# Altium project slam.PrjPCB
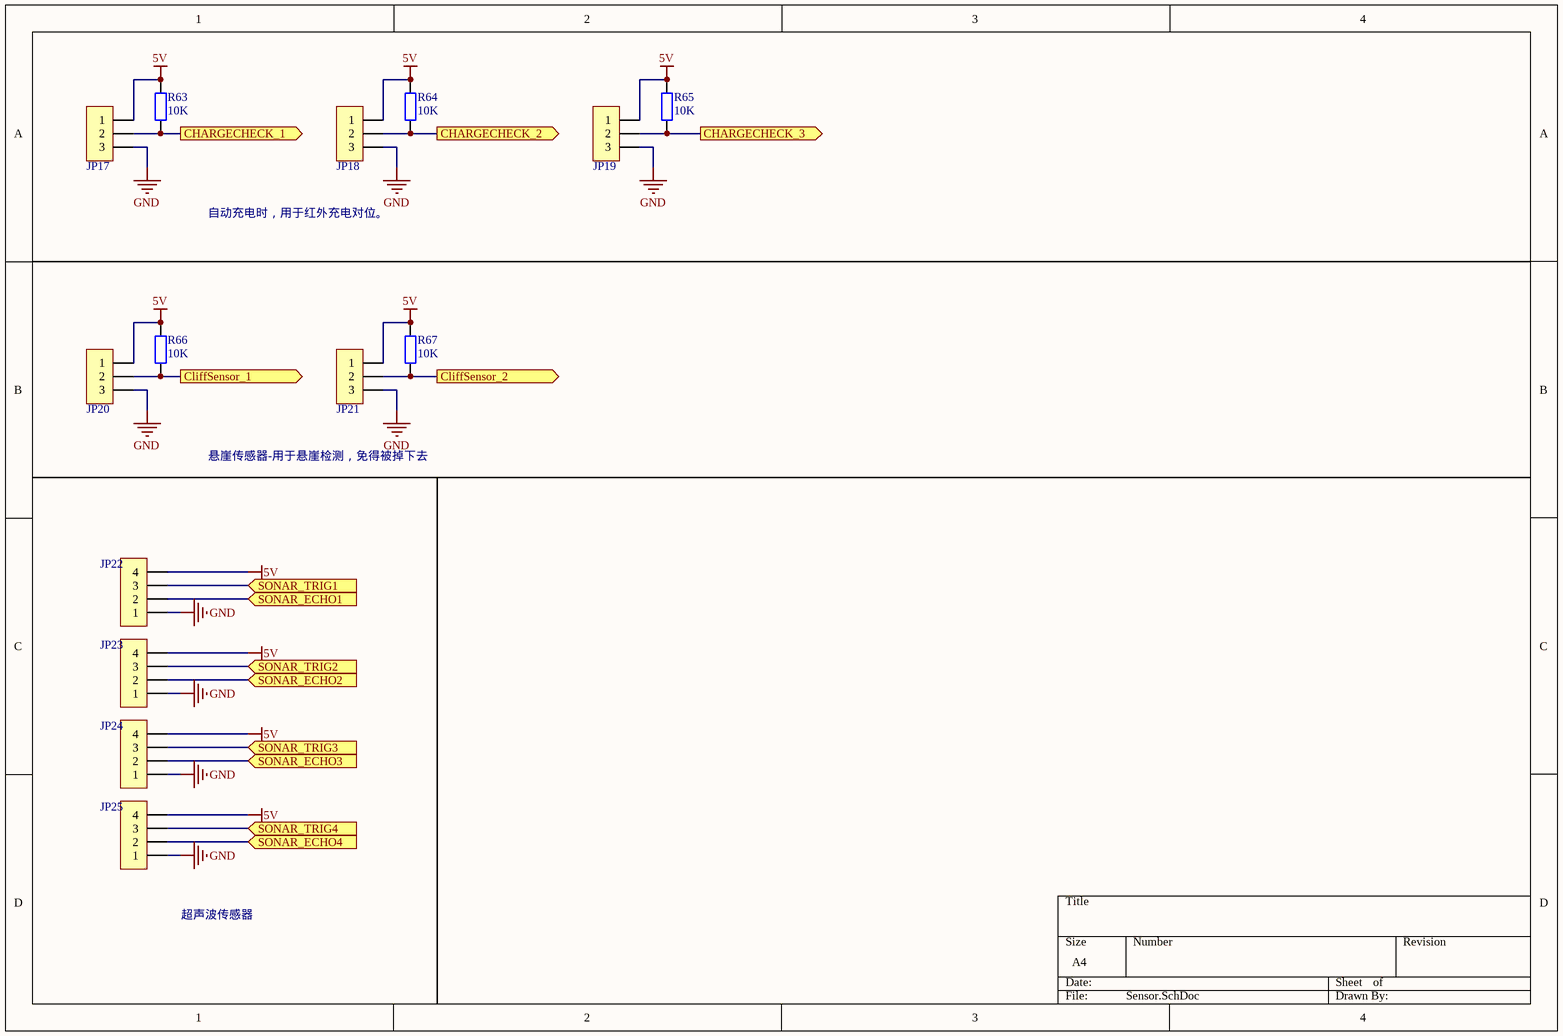
[diagram p0: Sensor.SchDoc]
5 sheets, 120 parts. Net scope: flat (ports and power ports of the same name join across sheets).
Board file: MAIN.PcbDoc
Sheets:
  Sensor.SchDoc
  main.SchDoc
  MOTO.SchDoc
  InputOutput.SchDoc
  tongxun.SchDoc

## Sheet Sensor.SchDoc
size A4

### Parts
JP17  HDR-1X3  [XH2.54-LI-3P]  (value not drawn)
JP18  HDR-1X3  [XH2.54-LI-3P]  (value not drawn)
JP19  HDR-1X3  [XH2.54-LI-3P]  (value not drawn)
JP20  HDR-1X3  [XH2.54-LI-3P]  (value not drawn)
JP21  HDR-1X3  [XH2.54-LI-3P]  (value not drawn)
JP22  HDR-1X4  [XH2.54-LI-4P]  (value not drawn)
JP23  HDR-1X4  [XH2.54-LI-4P]  (value not drawn)
JP24  HDR-1X4  [XH2.54-LI-4P]  (value not drawn)
JP25  HDR-1X4  [XH2.54-LI-4P]  (value not drawn)
R63  10K  [R 0603_M]
R64  10K  [R 0603_M]
R65  10K  [R 0603_M]
R66  10K  [R 0603_M]
R67  10K  [R 0603_M]

### Ports
CHARGECHECK_1 (out), CHARGECHECK_2 (out), CHARGECHECK_3 (out), CliffSensor_1 (out), CliffSensor_2 (out), SONAR_ECHO1 (in), SONAR_ECHO2 (in), SONAR_ECHO3 (in), SONAR_ECHO4 (in), SONAR_TRIG1 (in), SONAR_TRIG2 (in), SONAR_TRIG3 (in), SONAR_TRIG4 (in)

### Nets
5V: JP17.1 JP18.1 JP19.1 JP20.1 JP21.1 JP22.4 JP23.4 JP24.4 JP25.4 R63.2 R64.2 R65.2 R66.2 R67.2
GND: JP17.3 JP18.3 JP19.3 JP20.3 JP21.3 JP22.1 JP23.1 JP24.1 JP25.1
CHARGECHECK_1: JP17.2 R63.1 ; port CHARGECHECK_1
CHARGECHECK_2: JP18.2 R64.1 ; port CHARGECHECK_2
CHARGECHECK_3: JP19.2 R65.1 ; port CHARGECHECK_3
CliffSensor_1: JP21.2 R67.1 ; port CliffSensor_2
CliffSensor_2: JP20.2 R66.1 ; port CliffSensor_1
NetJP22_2: JP22.2 ; port SONAR_ECHO1
NetJP22_3: JP22.3 ; port SONAR_TRIG1
NetJP23_2: JP23.2 ; port SONAR_ECHO2
NetJP23_3: JP23.3 ; port SONAR_TRIG2
NetJP24_2: JP24.2 ; port SONAR_ECHO3
NetJP24_3: JP24.3 ; port SONAR_TRIG3
NetJP25_2: JP25.2 ; port SONAR_ECHO4
NetJP25_3: JP25.3 ; port SONAR_TRIG4

### Notes on the sheet
- 自动充电时，用于红外充电对位。
- 悬崖传感器-用于悬崖检测，免得被掉下去
- 超声波传感器

### Library data of the parts
JP17-JP21 = Header 3: 3P接插件; 版权归属: 源创客; BOM名称: 3P接插件; 学习资源: www.ooocke.com
JP22-JP25 = Header 4: 4P接插件; 版权归属: 源创客; BOM名称: 4P接插件; 学习资源: www.ooocke.com
R63-R67 = R: 贴片电阻; 版权归属: 源创客; BOM名称: 贴片电阻; 学习资源: www.ooocke.com

## Sheet main.SchDoc
size A3
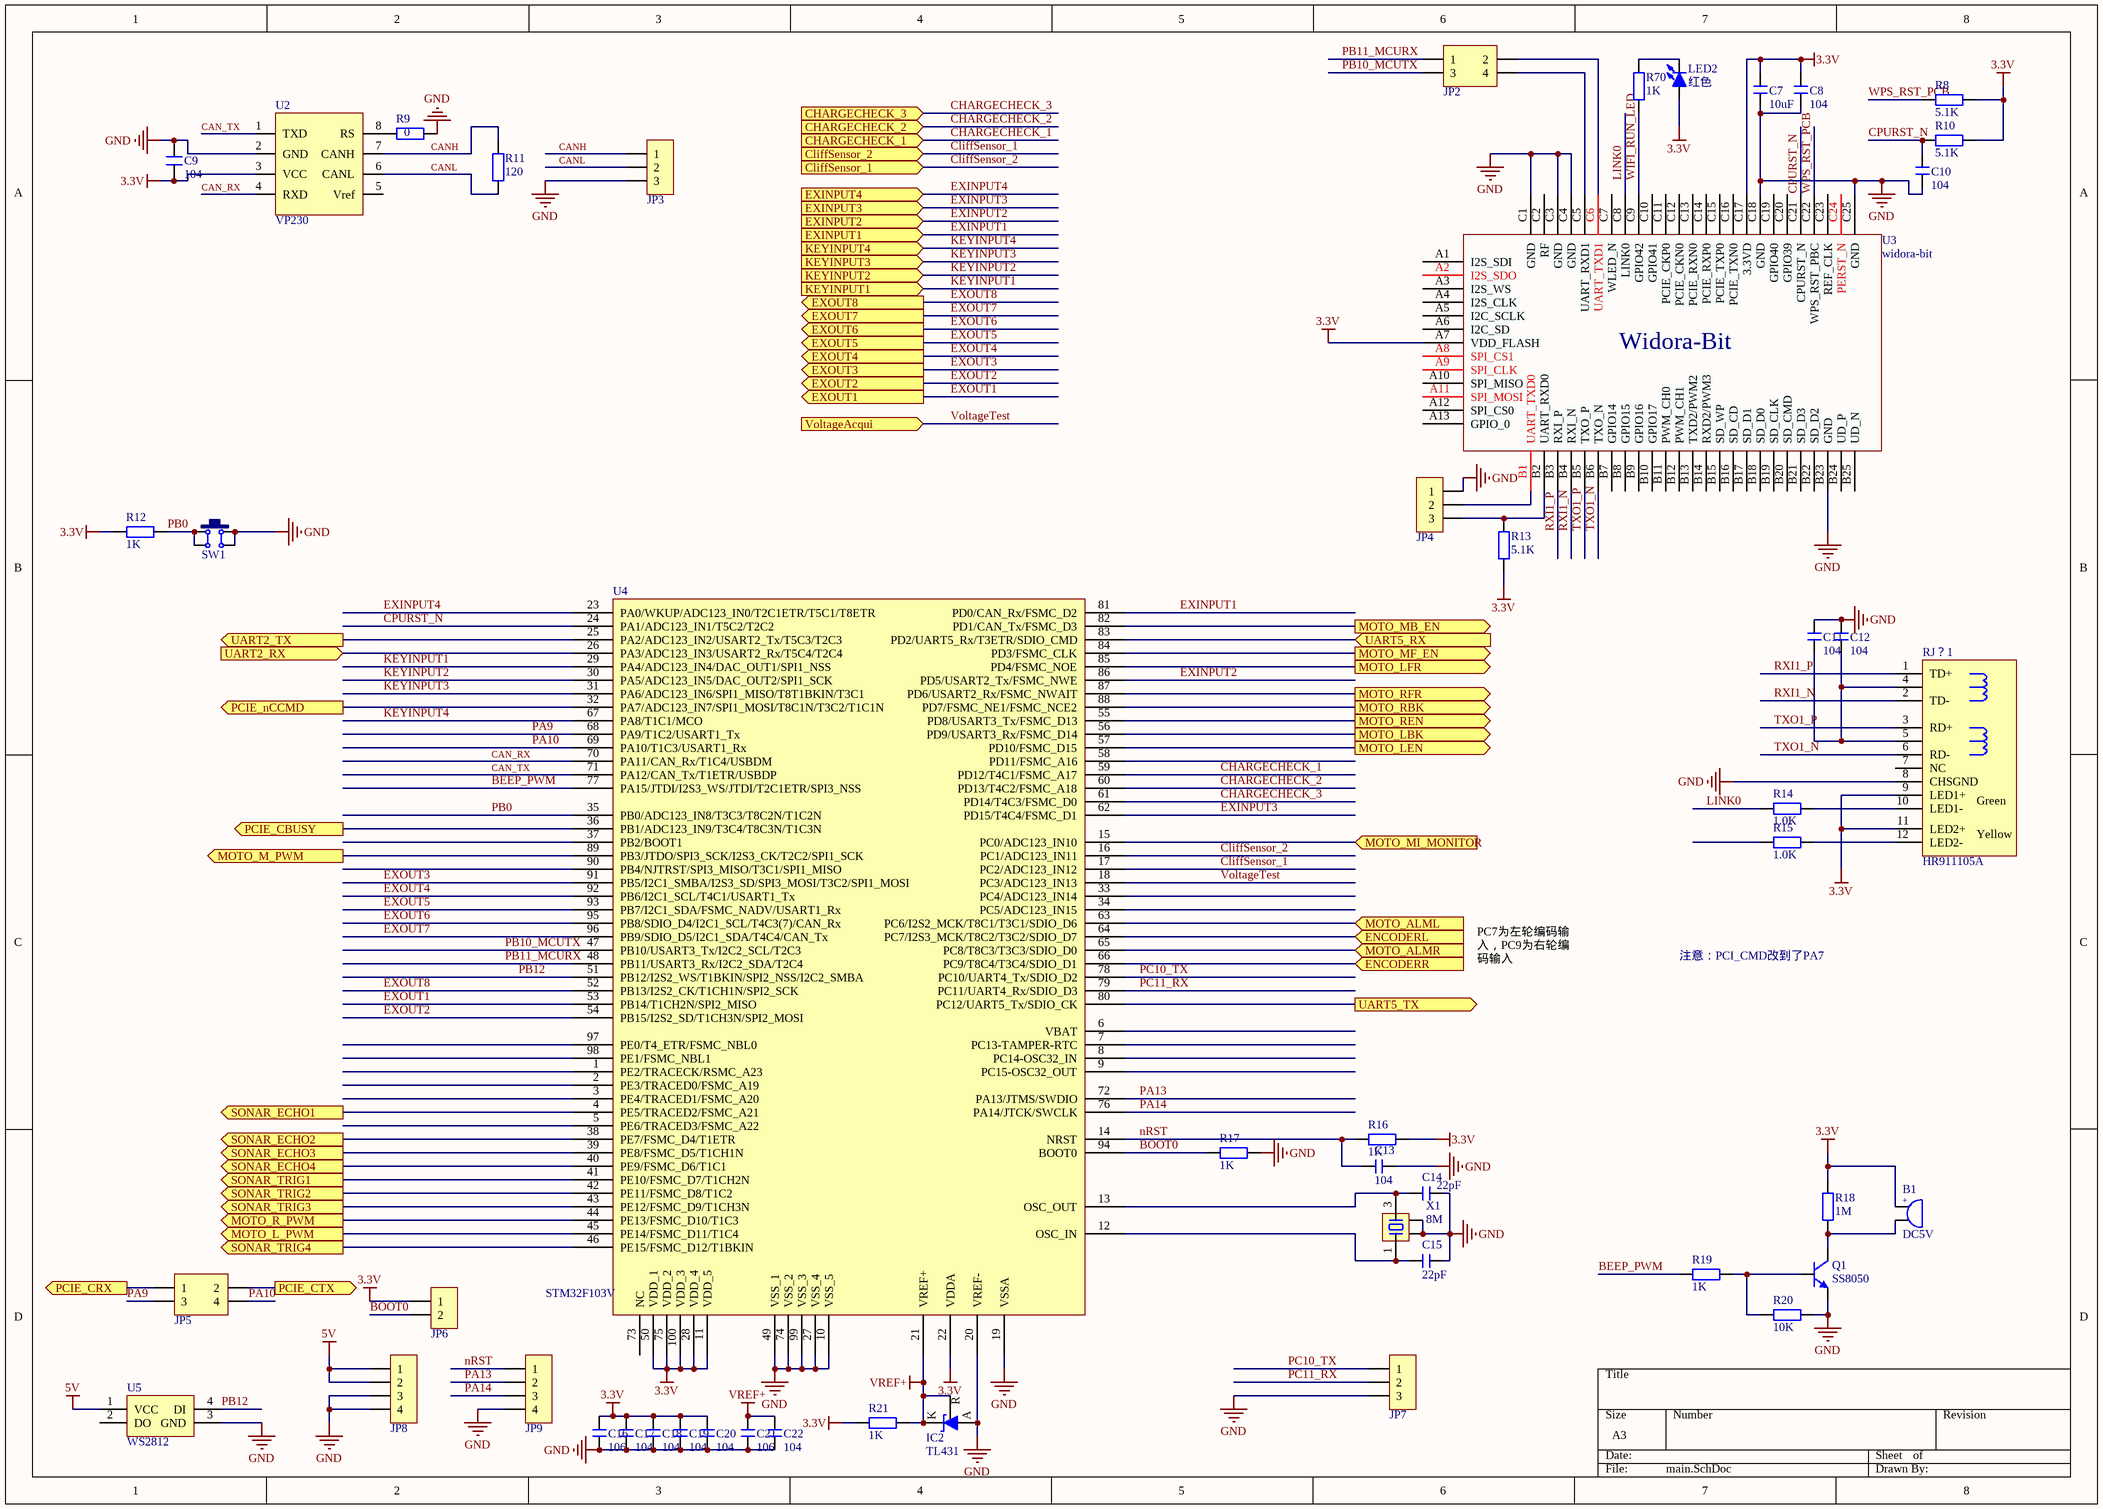
[diagram p1: main.SchDoc]

### Parts
B1  DC5V  [BEEP 6.5x12x8.5]
C7  10uF  [C 0805_L]
C8  104  [C 0603_L]
C9  104  [C 0603_L]
C10  104  [C 0603_L]
C11  104  [C 0603_L]
C12  104  [C 0603_L]
C13  104  [C 0603_L]
C14  22pF  [C 0603_L]
C15  22pF  [C 0603_L]
C16  106  [C 0603_L]
C17  104  [C 0603_L]
C18  104  [C 0603_L]
C19  104  [C 0603_L]
C20  104  [C 0603_L]
C21  106  [C 0603_L]
C22  104  [C 0603_L]
IC2  TL431  [SOT23-3N]
JP2  Header2X2  [HDR2.54-LI-2x2P]  (value not drawn)
JP3  HDR-1X3  [XH2.54-LI-3P]  (value not drawn)
JP4  HDR-1X3  [XH2.54-LI-3P]  (value not drawn)
JP5  Header2X2  [HDR2.54-LI-2x2P]  (value not drawn)
JP6  HDR-1X2  [HDR2.54-LI-2P]  (value not drawn)
JP7  HDR-1X3  [XH2.54-LI-3P]  (value not drawn)
JP8  HDR-1X4  [HDR2.54-LI-2x2P]  (value not drawn)
JP9  HDR-1X4  [XH2.54-LI-4P]  (value not drawn)
LED2  红色  [LED 0603G]
Q1  SS8050  [SOT23-3N]
R8  5.1K  [R 0603_L]
R9  0  [R 0603_L]
R10  5.1K  [R 0603_L]
R11  120  [R 0603_L]
R12  1K  [R 0603_L]
R13  5.1K  [R 0603_L]
R14  1.0K  [R 0603_L]
R15  1.0K  [R 0603_L]
R16  1K  [R 0603_L]
R17  1K  [R 0603_L]
R18  1M  [R 0603_L]
R19  1K  [R 0603_L]
R20  10K  [R 0603_L]
R21  1K  [R 0603_L]
R70  1K  [R 0603_L]
RJ？1  HR911105A  [RJ-45A12]
SW1  6x6x5  [TSW DIP-6*6*6]  (value not drawn)
U2  VP230  [SOP8_N]
U3  widora-bit  [Widora-BIT2]
U4  STM32F103V  [LQFP100 14X14_N]
U5  WS2812  [WS2812]
X1  8M  [OSC 3225-4P]

### Ports
CHARGECHECK_1 (in), CHARGECHECK_2 (in), CHARGECHECK_3 (in), CliffSensor_1 (in), CliffSensor_2 (in), ENCODERL (in), ENCODERR (in), EXINPUT1 (in), EXINPUT2 (in), EXINPUT3 (in), EXINPUT4 (in), EXOUT1 (out), EXOUT2 (out), EXOUT3 (out), EXOUT4 (out), EXOUT5 (out), EXOUT6 (out), EXOUT7 (out), EXOUT8 (out), KEYINPUT1 (in), KEYINPUT2 (in), KEYINPUT3 (in), KEYINPUT4 (in), MOTO_ALML (in), MOTO_ALMR (in), MOTO_L_PWM (out), MOTO_LBK (out), MOTO_LEN (out), MOTO_LFR (out), MOTO_M_PWM (out), MOTO_MB_EN (out), MOTO_MF_EN (out), MOTO_MI_MONITOR (in), MOTO_R_PWM (out), MOTO_RBK (out), MOTO_REN (out), MOTO_RFR (out), PCIE_CBUSY (out), PCIE_CRX (out), PCIE_CTX (out), PCIE_nCCMD (out), SONAR_ECHO1 (out), SONAR_ECHO2 (out), SONAR_ECHO3 (out), SONAR_ECHO4 (out), SONAR_TRIG1 (out), SONAR_TRIG2 (out), SONAR_TRIG3 (out), SONAR_TRIG4 (out), UART2_RX (in), UART2_TX (out), UART5_RX (in), UART5_TX (out), VoltageAcqui (in)

### Nets
3.3V: B1.1 C7.2 C8.2 C9.1 C16.2 C17.2 C18.2 C19.2 C20.2 JP6.1 LED2.1(A) R8.1 R10.1 R12.2 R13.2 R16.1 R18.2 R21.2 RJ？1.9(LED1+) RJ？1.11(LED2+) U2.3(VCC) U3.A7(VDD_FLASH) U3.C17(3.3VD) U4.11(VDD_5) U4.22(VDDA) U4.28(VDD_4) U4.50(VDD_1) U4.75(VDD_2) U4.100(VDD_3)
5V: JP8.1 JP8.2 U5.1(VCC)
GND: C7.1 C8.1 C9.2 C10.1 C11.2 C12.2 C13.1 C14.1 C15.1 C16.1 C17.1 C18.1 C19.1 C20.1 C21.1 C22.1 IC2.3(A) JP3.3 JP4.1 JP7.3 JP8.3 JP8.4 JP9.4 Q1.2(E) R9.2 R17.1 R20.1 RJ？1.8(CHSGND) SW1.2 SW1.3 U2.2(GND) U3.B23(GND) U3.C1(GND) U3.C3(GND) U3.C4(GND) U3.C18(GND) U3.C25(GND) U4.10(VSS_5) U4.19(VSSA) U4.20(VREF-) U4.27(VSS_4) U4.49(VSS_1) U4.74(VSS_2) U4.99(VSS_3) U5.3(GND) X1.2 X1.4
VREF+: C21.2 C22.2 IC2.1(R) IC2.2(K) R21.1 U4.21(VREF+)
BEEP_PWM: R19.2 U4.77(PA15/JTDI/I2S3_WS/JTDI/T2C1ETR/SPI3_NSS)
BOOT0: JP6.2 R17.2 U4.94(BOOT0)
CAN_RX: U2.4(RXD) U4.70(PA11/CAN_Rx/T1C4/USBDM)
CAN_TX: U2.1(TXD) U4.71(PA12/CAN_Tx/T1ETR/USBDP)
CANH: JP3.1 R11.2 U2.7(CANH)
CANL: JP3.2 R11.1 U2.6(CANL)
CHARGECHECK_1: U4.59(PD12/T4C1/FSMC_A17) ; port CHARGECHECK_1
CHARGECHECK_2: U4.60(PD13/T4C2/FSMC_A18) ; port CHARGECHECK_2
CHARGECHECK_3: U4.61(PD14/T4C3/FSMC_D0) ; port CHARGECHECK_3
CliffSensor_1: U4.17(PC2/ADC123_IN12) ; port CliffSensor_2
CliffSensor_2: U4.16(PC1/ADC123_IN11) ; port CliffSensor_1
CPURST_N: C10.2 R10.2 U3.C21(CPURST_N) U4.24(PA1/ADC123_IN1/T5C2/T2C2)
ENABLE_C: U4.89(PB3/JTDO/SPI3_SCK/I2S3_CK/T2C2/SPI1_SCK) ; port MOTO_M_PWM
EXINPUT1: U4.81(PD0/CAN_Rx/FSMC_D2) ; port EXINPUT1
EXINPUT2: U4.86(PD5/USART2_Tx/FSMC_NWE) ; port EXINPUT2
EXINPUT3: U4.62(PD15/T4C4/FSMC_D1) ; port EXINPUT3
EXINPUT4: U4.23(PA0/WKUP/ADC123_IN0/T2C1ETR/T5C1/T8ETR) ; port EXINPUT4
EXOUT1: U4.53(PB14/T1CH2N/SPI2_MISO) ; port EXOUT1
EXOUT2: U4.54(PB15/I2S2_SD/T1CH3N/SPI2_MOSI) ; port EXOUT2
EXOUT3: U4.91(PB5/I2C1_SMBA/I2S3_SD/SPI3_MOSI/T3C2/SPI1_MOSI) ; port EXOUT3
EXOUT4: U4.92(PB6/I2C1_SCL/T4C1/USART1_Tx) ; port EXOUT4
EXOUT5: U4.93(PB7/I2C1_SDA/FSMC_NADV/USART1_Rx) ; port EXOUT5
EXOUT6: U4.95(PB8/SDIO_D4/I2C1_SCL/T4C3(7)/CAN_Rx) ; port EXOUT6
EXOUT7: U4.96(PB9/SDIO_D5/I2C1_SDA/T4C4/CAN_Tx) ; port EXOUT7
EXOUT8: U4.52(PB13/I2S2_CK/T1CH1N/SPI2_SCK) ; port EXOUT8
INPUT_C1: U4.84(PD3/FSMC_CLK) ; port MOTO_MF_EN
INPUT_C2: U4.82(PD1/CAN_Tx/FSMC_D3) ; port MOTO_MB_EN
KEYINPUT1: U4.29(PA4/ADC123_IN4/DAC_OUT1/SPI1_NSS) ; port KEYINPUT1
KEYINPUT2: U4.30(PA5/ADC123_IN5/DAC_OUT2/SPI1_SCK) ; port KEYINPUT2
KEYINPUT3: U4.31(PA6/ADC123_IN6/SPI1_MISO/T8T1BKIN/T3C1) ; port KEYINPUT3
KEYINPUT4: U4.67(PA8/T1C1/MCO) ; port KEYINPUT4
LINK0: R14.1 U3.C8(LINK0)
nRST: C13.2 JP9.1 R16.2 U4.14(NRST)
PA9: JP5.3 U4.68(PA9/T1C2/USART1_Tx)
PA10: JP5.4 U4.69(PA10/T1C3/USART1_Rx)
PA13: JP9.2 U4.72(PA13/JTMS/SWDIO)
PA14: JP9.3 U4.76(PA14/JTCK/SWCLK)
PB0: R12.1 SW1.1 SW1.4 U4.35(PB0/ADC123_IN8/T3C3/T8C2N/T1C2N)
PB10_MCUTX: JP2.3 U4.47(PB10/USART3_Tx/I2C2_SCL/T2C3)
PB11_MCURX: JP2.1 U4.48(PB11/USART3_Rx/I2C2_SDA/T2C4)
PB12: U4.51(PB12/I2S2_WS/T1BKIN/SPI2_NSS/I2C2_SMBA) U5.4(DI)
PC10_TX: JP7.1 U4.78(PC10/UART4_Tx/SDIO_D2)
PC11_RX: JP7.2 U4.79(PC11/UART4_Rx/SDIO_D3)
RXI1_N: RJ？1.2(TD-) U3.B4(RXI_N)
RXI1_P: RJ？1.1(TD+) U3.B3(RXI_P)
TXO1_N: RJ？1.6(RD-) U3.B6(TXO_N)
TXO1_P: RJ？1.3(RD+) U3.B5(TXO_P)
VoltageTest: U4.18(PC3/ADC123_IN13) ; port VoltageAcqui
WIFI_RUN_LED: R70.2 U3.C9(GPIO42)
WPS_RST_PCB: R8.2 U3.C22(WPS_RST_PBC)
NetB1_2: B1.2 Q1.3(C) R18.1
NetC11_1: C11.1 C12.1 RJ？1.4 RJ？1.5
NetC14_2: C14.2 U4.13(OSC_OUT) X1.3
NetC15_2: C15.2 U4.12(OSC_IN) X1.1
NetJP2_2: JP2.2 U3.C6(UART_TXD1)
NetJP2_4: JP2.4 U3.C5(UART_RXD1)
NetJP4_2: JP4.2 U3.B1(UART_TXD0)
NetJP4_3: JP4.3 R13.1 U3.B2(UART_RXD0)
NetJP5_1: JP5.1 ; port PCIE_CRX
NetJP5_2: JP5.2 ; port PCIE_CTX
NetJP22_2: U4.4(PE5/TRACED2/FSMC_A21) ; port SONAR_ECHO1
NetJP22_3: U4.41(PE10/FSMC_D7/T1CH2N) ; port SONAR_TRIG1
NetJP23_2: U4.38(PE7/FSMC_D4/T1ETR) ; port SONAR_ECHO2
NetJP23_3: U4.42(PE11/FSMC_D8/T1C2) ; port SONAR_TRIG2
NetJP24_2: U4.39(PE8/FSMC_D5/T1CH1N) ; port SONAR_ECHO3
NetJP24_3: U4.43(PE12/FSMC_D9/T1CH3N) ; port SONAR_TRIG3
NetJP25_2: U4.40(PE9/FSMC_D6/T1C1) ; port SONAR_ECHO4
NetJP25_3: U4.46(PE15/FSMC_D12/T1BKIN) ; port SONAR_TRIG4
NetLED2_2: LED2.2(K) R70.1
NetQ1_1: Q1.1(B) R19.1 R20.2
NetR9_1: R9.1 U2.8(RS)
NetR14_2: R14.2 RJ？1.10(LED1-)
NetR15_2: R15.2 RJ？1.12(LED2-)
NetR28_1: U4.63(PC6/I2S2_MCK/T8C1/T3C1/SDIO_D6) ; port MOTO_ALML
NetR28_2: U4.64(PC7/I2S3_MCK/T8C2/T3C2/SDIO_D7) ; port ENCODERL
NetR28_3: U4.65(PC8/T8C3/T3C3/SDIO_D0) ; port MOTO_ALMR
NetR28_4: U4.66(PC9/T8C4/T3C4/SDIO_D1) ; port ENCODERR
NetU4_15: U4.15(PC0/ADC123_IN10) ; port MOTO_MI_MONITOR
NetU4_25: U4.25(PA2/ADC123_IN2/USART2_Tx/T5C3/T2C3) ; port UART2_TX
NetU4_26: U4.26(PA3/ADC123_IN3/USART2_Rx/T5C4/T2C4) ; port UART2_RX
NetU4_32: U4.32(PA7/ADC123_IN7/SPI1_MOSI/T8C1N/T3C2/T1C1N) ; port PCIE_nCCMD
NetU4_36: U4.36(PB1/ADC123_IN9/T3C4/T8C3N/T1C3N) ; port PCIE_CBUSY
NetU4_44: U4.44(PE13/FSMC_D10/T1C3) ; port MOTO_R_PWM
NetU4_45: U4.45(PE14/FSMC_D11/T1C4) ; port MOTO_L_PWM
NetU4_55: U4.55(PD8/USART3_Tx/FSMC_D13) ; port MOTO_REN
NetU4_56: U4.56(PD9/USART3_Rx/FSMC_D14) ; port MOTO_LBK
NetU4_57: U4.57(PD10/FSMC_D15) ; port MOTO_LEN
NetU4_80: U4.80(PC12/UART5_Tx/SDIO_CK) ; port UART5_TX
NetU4_83: U4.83(PD2/UART5_Rx/T3ETR/SDIO_CMD) ; port UART5_RX
NetU4_85: U4.85(PD4/FSMC_NOE) ; port MOTO_LFR
NetU4_87: U4.87(PD6/USART2_Rx/FSMC_NWAIT) ; port MOTO_RFR
NetU4_88: U4.88(PD7/FSMC_NE1/FSMC_NCE2) ; port MOTO_RBK

Not connected (* = marked no-connect by the designer): R15 1; RJ？1 7(NC); U2 5(Vref); U3 A1(I2S_SDI) A2(I2S_SDO) A3(I2S_WS) A4(I2S_CLK) A5(I2C_SCLK) A6(I2C_SD) A8(SPI_CS1) A9(SPI_CLK) A10(SPI_MISO) A11(SPI_MOSI) A12(SPI_CS0) A13(GPIO_0) B7(GPIO14) B8(GPIO15) B9(GPIO16) B10(GPIO17) B11(PWM_CH0) B12(PWM_CH1) B13(TXD2/PWM2) B14(RXD2/PWM3) B15(SD_WP) B16(SD_CD) B17(SD_D1) B18(SD_D0) B19(SD_CLK) B20(SD_CMD) B21(SD_D3) B22(SD_D2) B24(UD_P) B25(UD_N) C2(RF) C7(WLED_N) C10(GPIO41) C11(PCIE_CKP0) C12(PCIE_CKN0) C13(PCIE_RXN0) C14(PCIE_RXP0) C15(PCIE_TXP0) C16(PCIE_TXN0) C19(GPIO40) C20(GPIO39) C23(REF_CLK) C24(PERST_N); U4 1(PE2/TRACECK/RSMC_A23) 2(PE3/TRACED0/FSMC_A19) 3(PE4/TRACED1/FSMC_A20) 5(PE6/TRACED3/FSMC_A22) 6(VBAT) 7(PC13-TAMPER-RTC) 8(PC14-OSC32_IN) 9(PC15-OSC32_OUT) 33(PC4/ADC123_IN14) 34(PC5/ADC123_IN15) 37(PB2/BOOT1) 58(PD11/FSMC_A16) 73(NC) 90(PB4/NJTRST/SPI3_MISO/T3C1/SPI1_MISO) 97(PE0/T4_ETR/FSMC_NBL0) 98(PE1/FSMC_NBL1); U5 2(DO)

### Notes on the sheet
- PC7为左轮编码输入，PC9为右轮编码输入
- 注意：PCI_CMD改到了PA7
- (in symbol BEEP) +
- (in symbol HR911105A) Green; Yellow
- (in symbol widora-bit) Widora-Bit

### Library data of the parts
B1 = BEEP: 蜂鸣器; 版权归属: 源创客; BOM名称: 蜂鸣器; 学习资源: www.ooocke.com
C7 C8 C10-C22 = C: 无极性贴片电容; 版权归属: 源创客; BOM名称: 无极性贴片电容; 学习资源: www.ooocke.com
C9 = CAP_SMT_0603
IC2 = TL431_SMD: 可调基准稳压芯片; 版权归属: 源创客; BOM名称: 可调基准稳压芯片; 学习资源: www.ooocke.com
JP2 JP5 = Header 2X2: 2*2P接插件; 版权归属: 源创客; BOM名称: 2*2P接插件; 学习资源: www.ooocke.com
JP3 JP4 JP7 = Header 3: 3P接插件; 版权归属: 源创客; BOM名称: 3P接插件; 学习资源: www.ooocke.com
JP6 = Header 2: 2P接插件; 版权归属: 源创客; BOM名称: 2P接插件; 学习资源: www.ooocke.com
JP8 JP9 = Header 4: 4P接插件; 版权归属: 源创客; BOM名称: 4P接插件; 学习资源: www.ooocke.com
LED2 = LED-SMD: 贴片LED; 版权归属: 源创客; BOM名称: 贴片LED; 学习资源: www.ooocke.com
Q1 = 8050-SMD: 高频放大-NPN型; 版权归属: 源创客; 属性: 40V 1.5A 1W 100MHZ; BOM名称: 高频放大-NPN型; 学习资源: www.ooocke.com
R8 R10 R12-R21 R70 = R: 贴片电阻; 版权归属: 源创客; BOM名称: 贴片电阻; 学习资源: www.ooocke.com
R9 R11 = RES_SMT_0603
RJ？1 = HR911105A: 带灯以太网接口; 版权归属: 源创客; BOM名称: 带灯以太网接口; 学习资源: www.ooocke.com
SW1 = TSW DIP-6x6: 直插6x6轻触开关; 版权归属: 源创客; BOM名称: 直插6x6轻触开关; 学习资源: www.ooocke.com
U4 = STM32F103V: 32位STM单片机100引脚; 版权归属: 源创客; BOM名称: 32位STM单片机100引脚; 学习资源: www.ooocke.com
U5 = WS2812: 集成LED灯
X1 = XTAL-4P: 4脚无源晶振; 版权归属: 源创客; BOM名称: 4脚无源晶振; 学习资源: www.ooocke.com

## Sheet MOTO.SchDoc
size A3
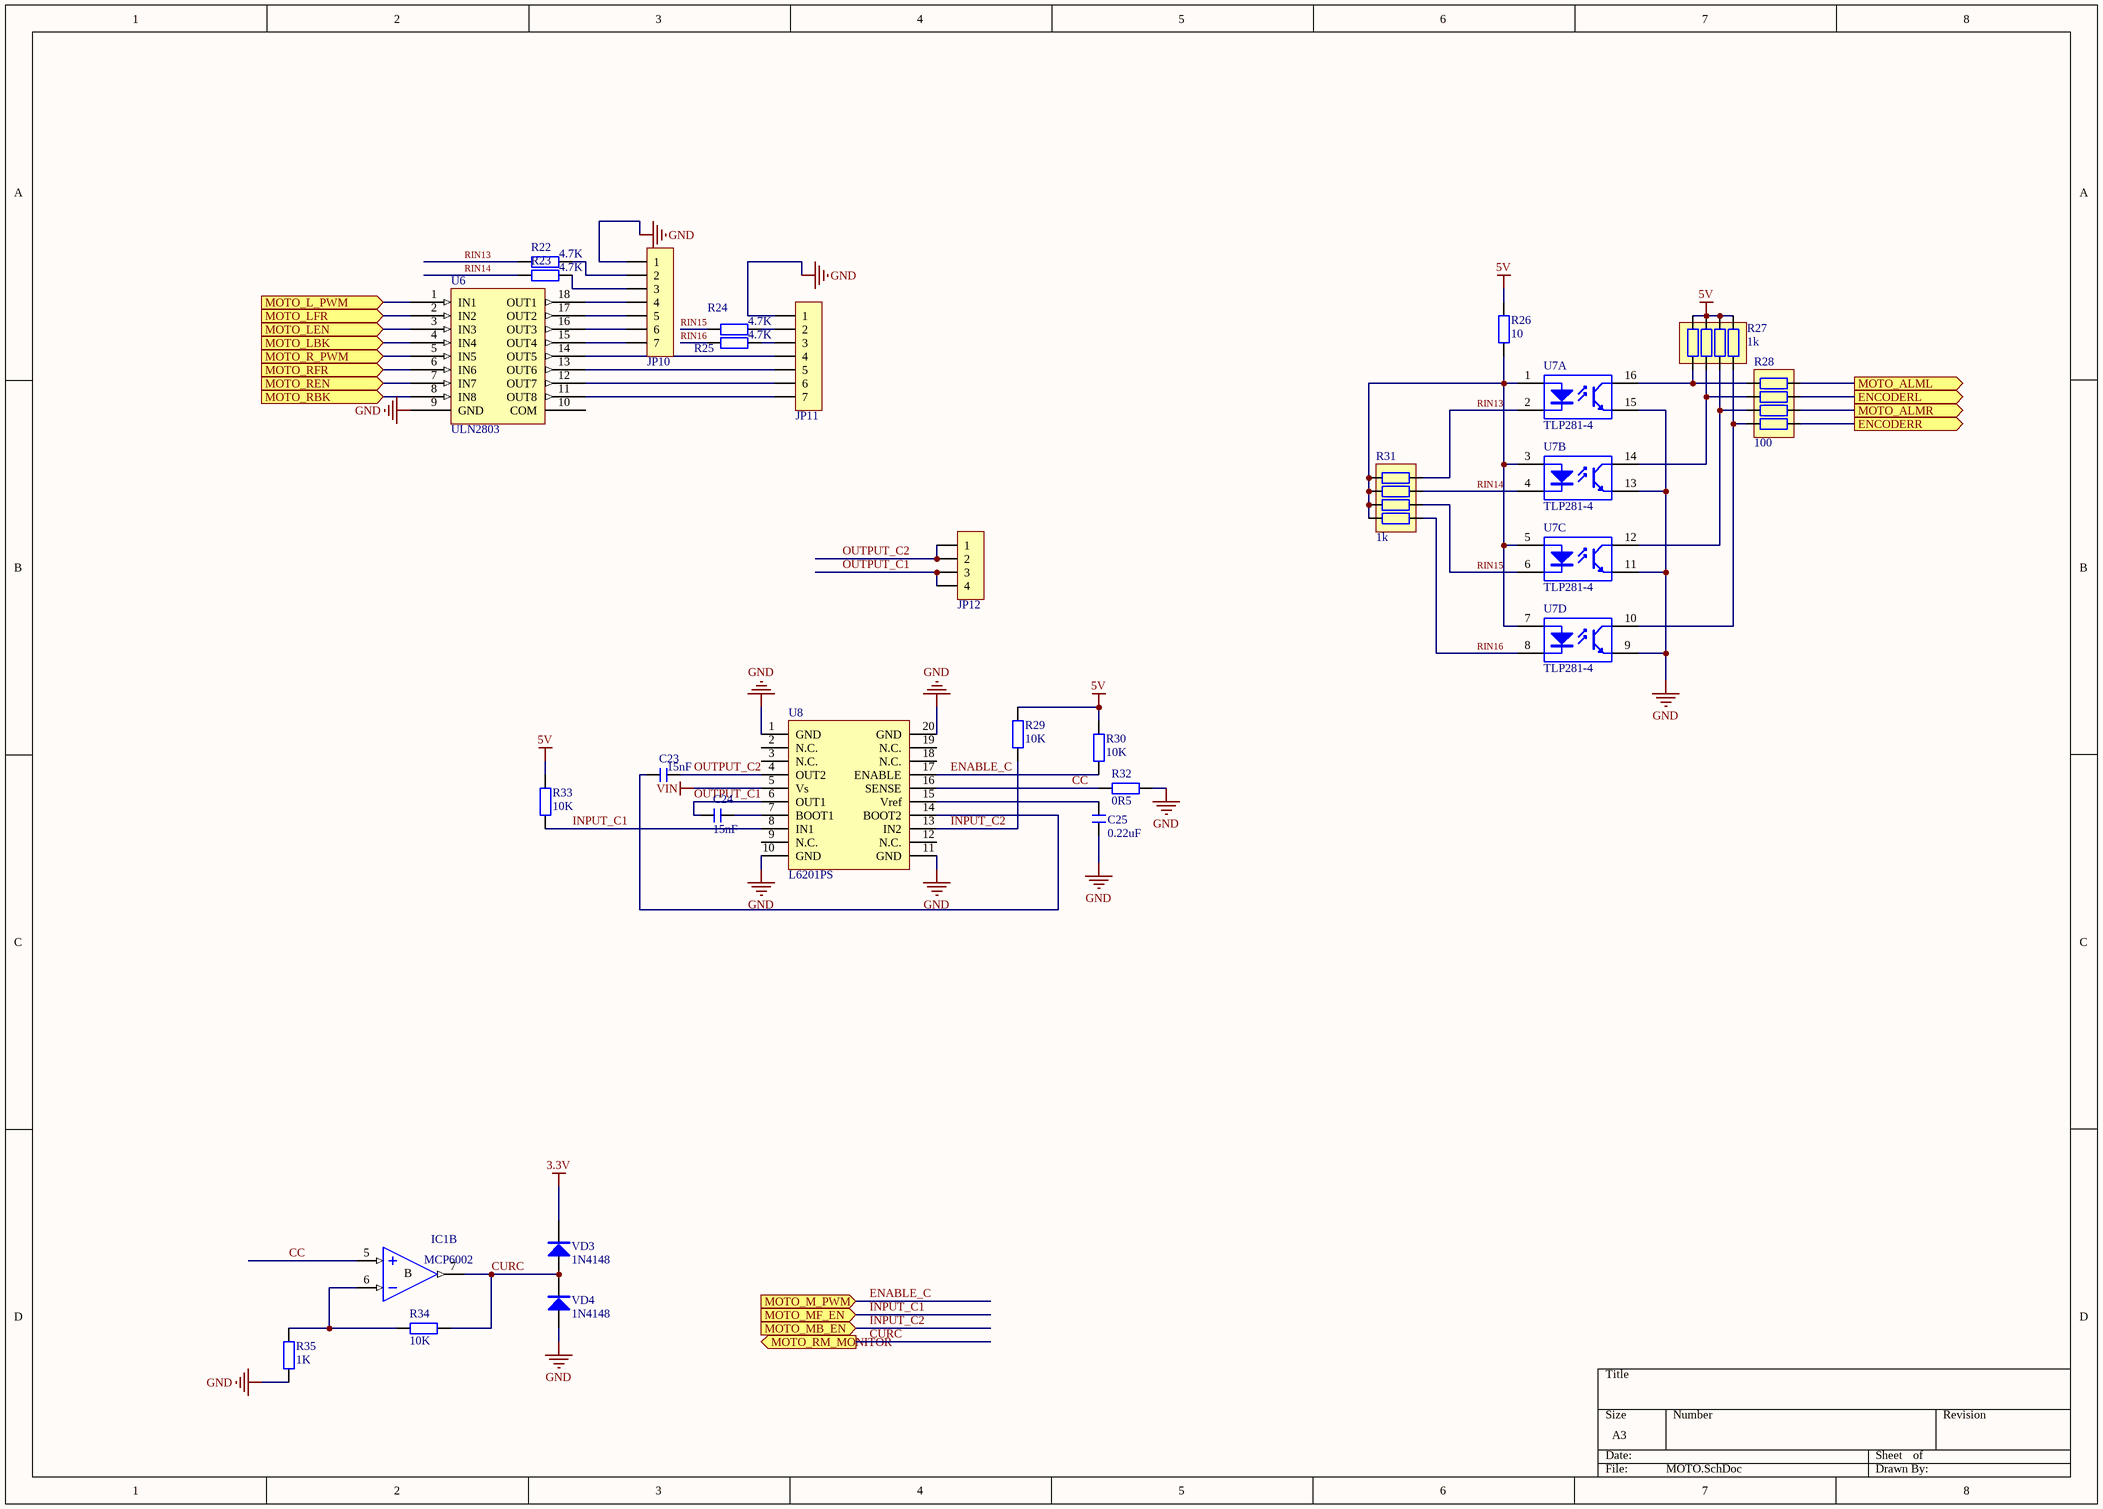
[diagram p2: MOTO.SchDoc]

### Parts
C23  15nF  [C 0603_L]
C24  15nF  [C 0603_L]
C25  0.22uF  [C 0603_L]
IC1  MCP6002  [SOP8_N]  (part B of 2)
JP10  HDR-1X7  [XH2.54-WI-7P]  (value not drawn)
JP11  HDR-1X7  [XH2.54-WI-7P]  (value not drawn)
JP12  HDR-1X4  [XH2.54-WI-4P]  (value not drawn)
R22  4.7K  [R 0603_L]
R23  4.7K  [R 0603_L]
R24  4.7K  [R 0603_L]
R25  4.7K  [R 0603_L]
R26  10  [R 0603_L]
R27  1k  [RCA-8P4R-0603]
R28  100  [RCA-8P4R-0603]
R29  10K  [R 0603_L]
R30  10K  [R 0603_L]
R31  1k  [RCA-8P4R-0603]
R32  0R5  [RS 3W-V7]
R33  10K  [R 0603_L]
R34  10K  [R 0603_L]
R35  1K  [R 0603_L]
U6  ULN2803  [SO-G18]
U7  TLP281-4  [SOP16N_N]  (parts A,B,C,D of 4)
U8  L6201PS  [SO_PowerSO20]
VD3  1N4148  [SOD-323]
VD4  1N4148  [SOD-323]

### Ports
ENCODERL (out), ENCODERR (out), MOTO_ALML (out), MOTO_ALMR (out), MOTO_L_PWM (in), MOTO_LBK (in), MOTO_LEN (in), MOTO_LFR (in), MOTO_M_PWM (in), MOTO_MB_EN (in), MOTO_MF_EN (in), MOTO_R_PWM (in), MOTO_RBK (in), MOTO_REN (in), MOTO_RFR (in), MOTO_RM_MONITOR (out)

### Nets
3.3V: VD3.2(K)
5V: R26.1 R27.5 R27.6 R27.7 R27.8 R29.2 R30.2 R33.2
GND: C25.1 JP10.1 JP11.1 R32.2 R35.1 U6.9(GND) U7.9 U7.11 U7.13 U7.15 U8.1(GND) U8.10(GND) U8.11(GND) U8.20(GND) VD4.1(A)
VIN: U8.5(Vs)
CC: IC1.5(IN+) R32.1 U8.16(SENSE)
CURC: IC1.7(OUT) R34.2 VD3.1(A) VD4.2(K) ; port MOTO_RM_MONITOR
ENABLE_C: R30.1 U8.17(ENABLE) ; port MOTO_M_PWM
INPUT_C1: R33.1 U8.8(IN1) ; port MOTO_MF_EN
INPUT_C2: R29.1 U8.13(IN2) ; port MOTO_MB_EN
OUTPUT_C1: C24.1 JP12.3 JP12.4 U8.6(OUT1)
OUTPUT_C2: C23.2 JP12.1 JP12.2 U8.4(OUT2)
RIN13: R22.2 R31.8 U7.2
RIN14: R23.2 R31.7 U7.4
RIN15: R24.2 R31.6 U7.6
RIN16: R25.2 R31.5 U7.8
NetC23_1: C23.1 U8.14(BOOT2)
NetC24_2: C24.2 U8.7(BOOT1)
NetC25_2: C25.2 U8.15(Vref)
NetIC1_6: IC1.6(IN-) R34.1 R35.2
NetJP10_2: JP10.2 R22.1
NetJP10_3: JP10.3 R23.1
NetJP10_4: JP10.4 U6.18(OUT1)
NetJP10_5: JP10.5 U6.17(OUT2)
NetJP10_6: JP10.6 U6.16(OUT3)
NetJP10_7: JP10.7 U6.15(OUT4)
NetJP11_2: JP11.2 R24.1
NetJP11_3: JP11.3 R25.1
NetJP11_4: JP11.4 U6.14(OUT5)
NetJP11_5: JP11.5 U6.13(OUT6)
NetJP11_6: JP11.6 U6.12(OUT7)
NetJP11_7: JP11.7 U6.11(OUT8)
NetR26_2: R26.2 R31.1 R31.2 R31.3 R31.4 U7.1 U7.3 U7.5 U7.7
NetR27_1: R27.1 R28.8 U7.16
NetR27_2: R27.2 R28.7 U7.14
NetR27_3: R27.3 R28.6 U7.12
NetR27_4: R27.4 R28.5 U7.10
NetR28_1: R28.1 ; port MOTO_ALML
NetR28_2: R28.2 ; port ENCODERL
NetR28_3: R28.3 ; port MOTO_ALMR
NetR28_4: R28.4 ; port ENCODERR
NetU4_44: U6.5(IN5) ; port MOTO_R_PWM
NetU4_45: U6.1(IN1) ; port MOTO_L_PWM
NetU4_55: U6.7(IN7) ; port MOTO_REN
NetU4_56: U6.4(IN4) ; port MOTO_LBK
NetU4_57: U6.3(IN3) ; port MOTO_LEN
NetU4_85: U6.2(IN2) ; port MOTO_LFR
NetU4_87: U6.6(IN6) ; port MOTO_RFR
NetU4_88: U6.8(IN8) ; port MOTO_RBK

Not connected (* = marked no-connect by the designer): U6 10(COM); U8 2(N.C.) 3(N.C.) 9(N.C.) 12(N.C.) 18(N.C.) 19(N.C.)

### Notes on the sheet
- (in symbol LM358, part B) B

### Library data of the parts
C23-C25 = C: 无极性贴片电容; 版权归属: 源创客; BOM名称: 无极性贴片电容; 学习资源: www.ooocke.com
IC1 = LM358: 双路运放; 版权归属: 源创客; BOM名称: 双路运放; 学习资源: www.ooocke.com
JP10 JP11 = Header 7: 7P接插件; 版权归属: 源创客; BOM名称: 7P接插件; 学习资源: www.ooocke.com
JP12 = Header 4: 4P接插件; 版权归属: 源创客; BOM名称: 4P接插件; 学习资源: www.ooocke.com
R22-R26 R29 R30 R33-R35 = R: 贴片电阻; 版权归属: 源创客; BOM名称: 贴片电阻; 学习资源: www.ooocke.com
R27 R28 R31 = R-8P4R: 贴片网络排阻; 版权归属: 源创客; BOM名称: 贴片网络排阻; 学习资源: www.ooocke.com
R32 = R-CRR: 直插色环电阻; BOM名称: 色环电阻; 版权归属: 源创客; 学习资源: www.ooocke.com
U8 = L6201PS: 电机驱动H桥
VD3 VD4 = 1N4148: 高速开关二极管; 版权归属: 源创客; BOM名称: 高速开关二极管; 学习资源: www.ooocke.com

## Sheet InputOutput.SchDoc
size A4
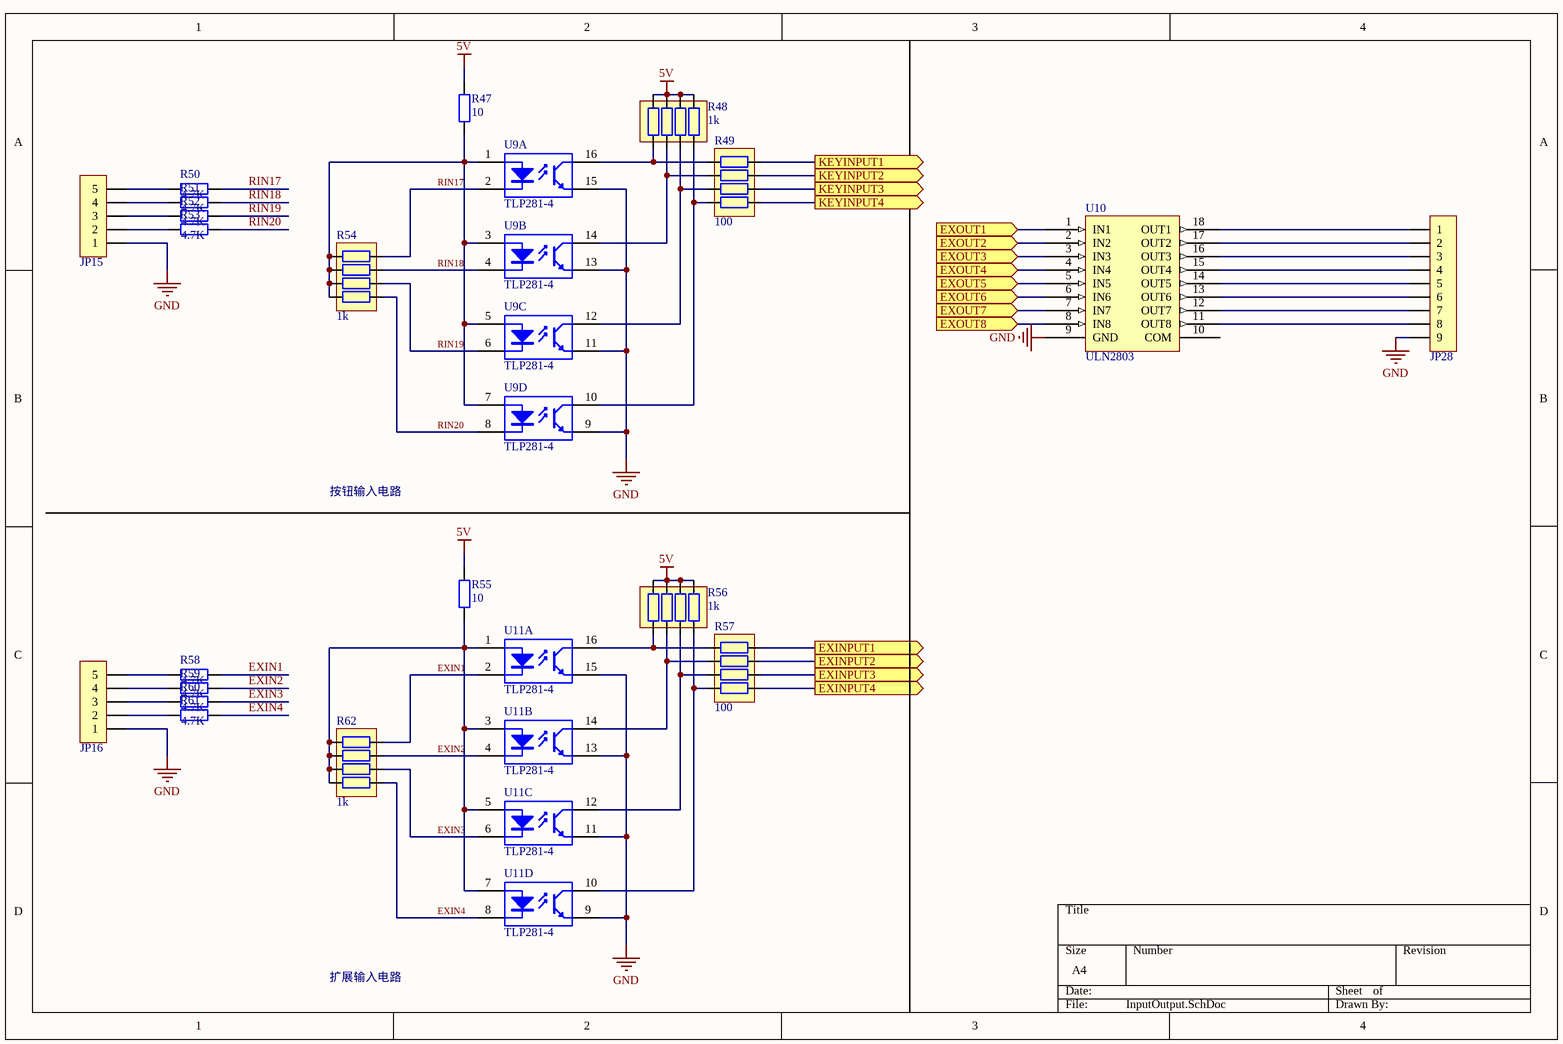
[diagram p3: InputOutput.SchDoc]

### Parts
JP15  HDR-1X5  [XH2.54-LI-5P]  (value not drawn)
JP16  HDR-1X5  [XH2.54-LI-5P]  (value not drawn)
JP28  HDR-1X9  [XH2.54-LI-9P]  (value not drawn)
R47  10  [R 0603_L]
R48  1k  [RCA-8P4R-0603]
R49  100  [RCA-8P4R-0603]
R50  4.7K  [R 0603_L]
R51  4.7K  [R 0603_L]
R52  4.7K  [R 0603_L]
R53  4.7K  [R 0603_L]
R54  1k  [RCA-8P4R-0603]
R55  10  [R 0603_L]
R56  1k  [RCA-8P4R-0603]
R57  100  [RCA-8P4R-0603]
R58  4.7K  [R 0603_L]
R59  4.7K  [R 0603_L]
R60  4.7K  [R 0603_L]
R61  4.7K  [R 0603_L]
R62  1k  [RCA-8P4R-0603]
U9  TLP281-4  [SOP16N_N]  (parts A,B,C,D of 4)
U10  ULN2803  [SO-G18]
U11  TLP281-4  [SOP16N_N]  (parts A,B,C,D of 4)

### Ports
EXINPUT1 (out), EXINPUT2 (out), EXINPUT3 (out), EXINPUT4 (out), EXOUT1 (in), EXOUT2 (in), EXOUT3 (in), EXOUT4 (in), EXOUT5 (in), EXOUT6 (in), EXOUT7 (in), EXOUT8 (in), KEYINPUT1 (out), KEYINPUT2 (out), KEYINPUT3 (out), KEYINPUT4 (out)

### Nets
5V: R47.1 R48.5 R48.6 R48.7 R48.8 R55.1 R56.5 R56.6 R56.7 R56.8
GND: JP15.1 JP16.1 JP28.9 U9.9 U9.11 U9.13 U9.15 U10.9(GND) U11.9 U11.11 U11.13 U11.15
EXIN1: R58.1 R62.8 U11.2
EXIN2: R59.1 R62.7 U11.4
EXIN3: R60.1 R62.6 U11.6
EXIN4: R61.1 R62.5 U11.8
EXINPUT1: R57.1 ; port EXINPUT1
EXINPUT2: R57.2 ; port EXINPUT2
EXINPUT3: R57.3 ; port EXINPUT3
EXINPUT4: R57.4 ; port EXINPUT4
EXOUT1: U10.1(IN1) ; port EXOUT1
EXOUT2: U10.2(IN2) ; port EXOUT2
EXOUT3: U10.3(IN3) ; port EXOUT3
EXOUT4: U10.4(IN4) ; port EXOUT4
EXOUT5: U10.5(IN5) ; port EXOUT5
EXOUT6: U10.6(IN6) ; port EXOUT6
EXOUT7: U10.7(IN7) ; port EXOUT7
EXOUT8: U10.8(IN8) ; port EXOUT8
KEYINPUT1: R49.1 ; port KEYINPUT1
KEYINPUT2: R49.2 ; port KEYINPUT2
KEYINPUT3: R49.3 ; port KEYINPUT3
KEYINPUT4: R49.4 ; port KEYINPUT4
RIN17: R50.1 R54.8 U9.2
RIN18: R51.1 R54.7 U9.4
RIN19: R52.1 R54.6 U9.6
RIN20: R53.1 R54.5 U9.8
NetJP15_2: JP15.2 R53.2
NetJP15_3: JP15.3 R52.2
NetJP15_4: JP15.4 R51.2
NetJP15_5: JP15.5 R50.2
NetJP16_2: JP16.2 R61.2
NetJP16_3: JP16.3 R60.2
NetJP16_4: JP16.4 R59.2
NetJP16_5: JP16.5 R58.2
NetJP28_1: JP28.1 U10.18(OUT1)
NetJP28_2: JP28.2 U10.17(OUT2)
NetJP28_3: JP28.3 U10.16(OUT3)
NetJP28_4: JP28.4 U10.15(OUT4)
NetJP28_5: JP28.5 U10.14(OUT5)
NetJP28_6: JP28.6 U10.13(OUT6)
NetJP28_7: JP28.7 U10.12(OUT7)
NetJP28_8: JP28.8 U10.11(OUT8)
NetR47_2: R47.2 R54.1 R54.2 R54.3 R54.4 U9.1 U9.3 U9.5 U9.7
NetR48_1: R48.1 R49.8 U9.16
NetR48_2: R48.2 R49.7 U9.14
NetR48_3: R48.3 R49.6 U9.12
NetR48_4: R48.4 R49.5 U9.10
NetR55_2: R55.2 R62.1 R62.2 R62.3 R62.4 U11.1 U11.3 U11.5 U11.7
NetR56_1: R56.1 R57.8 U11.16
NetR56_2: R56.2 R57.7 U11.14
NetR56_3: R56.3 R57.6 U11.12
NetR56_4: R56.4 R57.5 U11.10

Not connected (* = marked no-connect by the designer): U10 10(COM)

### Notes on the sheet
- 按钮输入电路
- 扩展输入电路

### Library data of the parts
JP15 JP16 = Header 5: 5P接插件; 版权归属: 源创客; BOM名称: 5P接插件; 学习资源: www.ooocke.com
JP28 = Header 9: 9P接插件; 版权归属: 源创客; BOM名称: 9P接插件; 学习资源: www.ooocke.com
R47 R50-R53 R55 R58-R61 = R: 贴片电阻; 版权归属: 源创客; BOM名称: 贴片电阻; 学习资源: www.ooocke.com
R48 R49 R54 R56 R57 R62 = R-8P4R: 贴片网络排阻; 版权归属: 源创客; BOM名称: 贴片网络排阻; 学习资源: www.ooocke.com

## Sheet tongxun.SchDoc
size A4
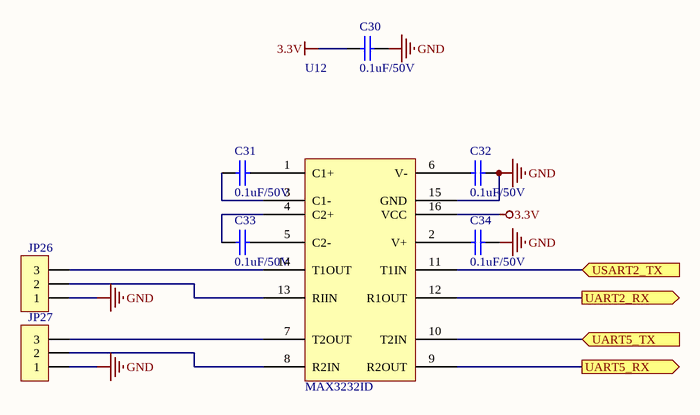
[diagram p4: tongxun.SchDoc]

### Parts
C30  0.1uF/50V  [C 0603_L]
C31  0.1uF/50V  [C 0603_L]
C32  0.1uF/50V  [C 0603_L]
C33  0.1uF/50V  [C 0603_L]
C34  0.1uF/50V  [C 0603_L]
JP26  HDR-1X3  [XH2.54-LI-3P]  (value not drawn)
JP27  HDR-1X3  [XH2.54-LI-3P]  (value not drawn)
U12  MAX3232ID  [SOP16_n]

### Ports
UART2_RX (out), UART5_RX (out), UART5_TX (in), USART2_TX (in)

### Nets
3.3V: C30.1 U12.16(VCC)
GND: C30.2 C32.2 C34.2 JP26.1 JP27.1 U12.15(GND)
NetC31_1: C31.1 U12.3(C1-)
NetC31_2: C31.2 U12.1(C1+)
NetC32_1: C32.1 U12.6(V-)
NetC33_1: C33.1 U12.4(C2+)
NetC33_2: C33.2 U12.5(C2-)
NetC34_1: C34.1 U12.2(V+)
NetJP26_2: JP26.2 U12.13(RIIN)
NetJP26_3: JP26.3 U12.14(T1OUT)
NetJP27_2: JP27.2 U12.8(R2IN)
NetJP27_3: JP27.3 U12.7(T2OUT)
NetU4_26: U12.12(R1OUT) ; port UART2_RX
NetU4_80: U12.10(T2IN) ; port UART5_TX
NetU4_83: U12.9(R2OUT) ; port UART5_RX
NetU12_11: U12.11(T1IN) ; port USART2_TX

### Library data of the parts
C30-C34 = CAP: 片式X7R电容
JP26 JP27 = Header 3: 3P接插件; 版权归属: 源创客; BOM名称: 3P接插件; 学习资源: www.ooocke.com
U12 = MAX232: 贴片集成电路

## Nets that join several sheets
3.3V: main (29 pins), MOTO (VD3.2), tongxun (C30.1 U12.16)
5V: Sensor (14 pins), main (JP8.1 JP8.2 U5.1), MOTO (8 pins), InputOutput (10 pins)
GND: Sensor (9 pins), main (47 pins), MOTO (15 pins), InputOutput (12 pins), tongxun (6 pins)
CHARGECHECK_1: Sensor (JP17.2 R63.1), main (U4.59)
CHARGECHECK_2: Sensor (JP18.2 R64.1), main (U4.60)
CHARGECHECK_3: Sensor (JP19.2 R65.1), main (U4.61)
CliffSensor_1: Sensor (JP21.2 R67.1), main (U4.17)
CliffSensor_2: Sensor (JP20.2 R66.1), main (U4.16)
ENABLE_C: main (U4.89), MOTO (R30.1 U8.17)
EXINPUT1: main (U4.81), InputOutput (R57.1)
EXINPUT2: main (U4.86), InputOutput (R57.2)
EXINPUT3: main (U4.62), InputOutput (R57.3)
EXINPUT4: main (U4.23), InputOutput (R57.4)
EXOUT1: main (U4.53), InputOutput (U10.1)
EXOUT2: main (U4.54), InputOutput (U10.2)
EXOUT3: main (U4.91), InputOutput (U10.3)
EXOUT4: main (U4.92), InputOutput (U10.4)
EXOUT5: main (U4.93), InputOutput (U10.5)
EXOUT6: main (U4.95), InputOutput (U10.6)
EXOUT7: main (U4.96), InputOutput (U10.7)
EXOUT8: main (U4.52), InputOutput (U10.8)
INPUT_C1: main (U4.84), MOTO (R33.1 U8.8)
INPUT_C2: main (U4.82), MOTO (R29.1 U8.13)
KEYINPUT1: main (U4.29), InputOutput (R49.1)
KEYINPUT2: main (U4.30), InputOutput (R49.2)
KEYINPUT3: main (U4.31), InputOutput (R49.3)
KEYINPUT4: main (U4.67), InputOutput (R49.4)
NetJP22_2: Sensor (JP22.2), main (U4.4)
NetJP22_3: Sensor (JP22.3), main (U4.41)
NetJP23_2: Sensor (JP23.2), main (U4.38)
NetJP23_3: Sensor (JP23.3), main (U4.42)
NetJP24_2: Sensor (JP24.2), main (U4.39)
NetJP24_3: Sensor (JP24.3), main (U4.43)
NetJP25_2: Sensor (JP25.2), main (U4.40)
NetJP25_3: Sensor (JP25.3), main (U4.46)
NetR28_1: main (U4.63), MOTO (R28.1)
NetR28_2: main (U4.64), MOTO (R28.2)
NetR28_3: main (U4.65), MOTO (R28.3)
NetR28_4: main (U4.66), MOTO (R28.4)
NetU4_26: main (U4.26), tongxun (U12.12)
NetU4_44: main (U4.44), MOTO (U6.5)
NetU4_45: main (U4.45), MOTO (U6.1)
NetU4_55: main (U4.55), MOTO (U6.7)
NetU4_56: main (U4.56), MOTO (U6.4)
NetU4_57: main (U4.57), MOTO (U6.3)
NetU4_80: main (U4.80), tongxun (U12.10)
NetU4_83: main (U4.83), tongxun (U12.9)
NetU4_85: main (U4.85), MOTO (U6.2)
NetU4_87: main (U4.87), MOTO (U6.6)
NetU4_88: main (U4.88), MOTO (U6.8)